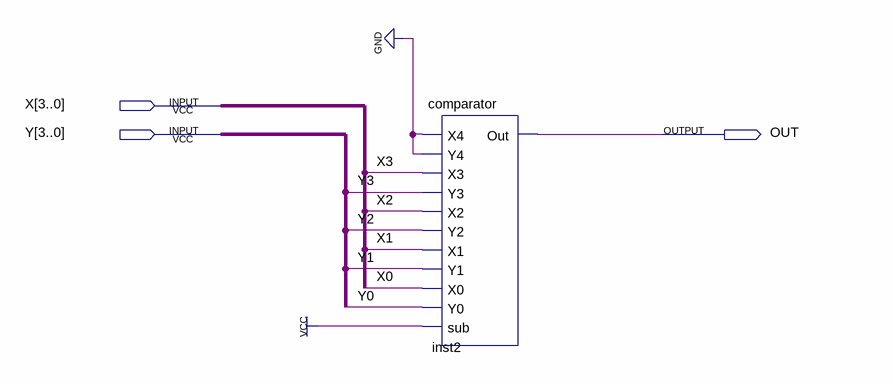
[diagram p0: schematic sheet]
// Quartus schematic bus_comparator.bdf as structural Verilog: 1 symbols, 3 pins
module bus_comparator (
  input  [3:0] X,
  input  [3:0] Y,
  output OUT
);

  comparator inst2 (
    .X4(1'b0), .Y4(1'b0), .X3(X[3]), .Y3(Y[3]), .X2(X[2]), .Y2(Y[2]), .X1(X[1]), .Y1(Y[1]), .X0(X[0]),
    .Y0(Y[0]), .sub(1'b1), .Out(OUT));
endmodule
